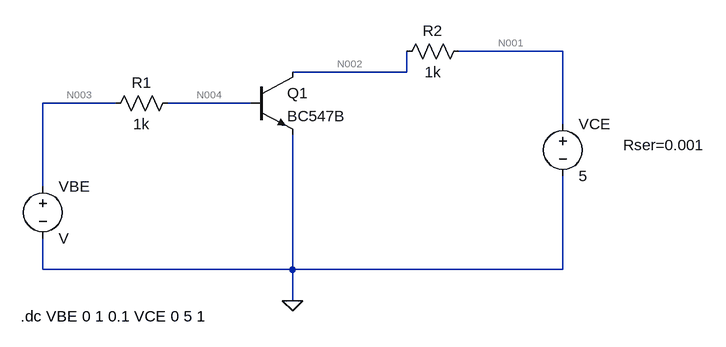
[diagram p0: schematic Draft1.asc]
Draft1.asc, the LTspice schematic file:
Version 4
SHEET 1 880 680
WIRE -160 -512 -320 -512
WIRE -400 -480 -400 -512
WIRE -400 -480 -576 -480
WIRE -848 -432 -960 -432
WIRE -640 -432 -768 -432
WIRE -160 -400 -160 -512
WIRE -960 -304 -960 -432
WIRE -960 -176 -960 -224
WIRE -576 -176 -576 -384
WIRE -576 -176 -960 -176
WIRE -160 -176 -160 -320
WIRE -160 -176 -576 -176
WIRE -576 -128 -576 -176
FLAG -576 -128 0
SYMBOL npn -640 -480 R0
SYMATTR InstName Q1
SYMATTR Value BC547B
SYMBOL voltage -960 -320 R0
SYMATTR InstName VBE
SYMBOL voltage -160 -416 R0
WINDOW 123 0 0 Left 0
WINDOW 39 93 48 Left 2
SYMATTR InstName VCE
SYMATTR Value 5
SYMATTR SpiceLine Rser=0.001
SYMBOL res -752 -448 R90
WINDOW 0 0 56 VBottom 2
WINDOW 3 32 56 VTop 2
SYMATTR InstName R1
SYMATTR Value 1k
SYMBOL res -304 -528 R90
WINDOW 0 0 56 VBottom 2
WINDOW 3 32 56 VTop 2
SYMATTR InstName R2
SYMATTR Value 1k
TEXT -994 -104 Left 2 !.dc VBE 0 1 0.1 VCE 0 5 1

The netlist it stands for:
* Draft1.asc
Q1 N002 N004 0 0 BC547B
VBE N003 0 V
VCE N001 0 5 Rser=0.001
R1 N004 N003 1k
R2 N001 N002 1k
.model NPN NPN
.model PNP PNP
.lib standard.bjt
.dc VBE 0 1 0.1 VCE 0 5 1
.backanno
.end

* Results of the author's LTspice run, read from the files saved beside the schematic
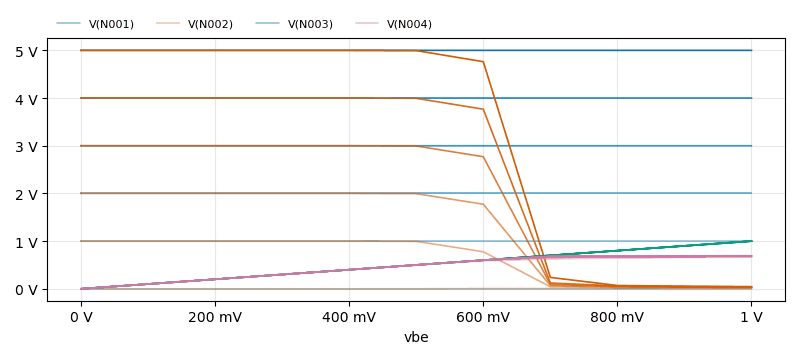
[diagram p1: DC transfer characteristic of Draft1.asc, plotted from the saved traces]
* DC transfer characteristic, 6 runs:
*   V(N001) [vce=0]: 0 V at vbe=0 V, 6.503 nV at vbe=1 V, min 0 V, max 6.503 nV
*   V(N001) [vce=1]: 1 V at vbe=0 V, 1 V at vbe=1 V, min 1 V, max 1 V
*   V(N001) [vce=2]: 2 V at vbe=0 V, 2 V at vbe=1 V, min 2 V, max 2 V
*   V(N001) [vce=3]: 3 V at vbe=0 V, 3 V at vbe=1 V, min 3 V, max 3 V
*   V(N001) [vce=4]: 4 V at vbe=0 V, 4 V at vbe=1 V, min 4 V, max 4 V
*   V(N001) [vce=5]: 5 V at vbe=0 V, 5 V at vbe=1 V, min 5 V, max 5 V
*   V(N002) [vce=0]: 0 V at vbe=0 V, 6.503 mV at vbe=1 V, min 0 V, max 6.503 mV
*   V(N002) [vce=1]: 1 V at vbe=0 V, 17.13 mV at vbe=1 V, min 17.13 mV, max 1 V
*   V(N002) [vce=2]: 2 V at vbe=0 V, 25.79 mV at vbe=1 V, min 25.79 mV, max 2 V
*   V(N002) [vce=3]: 3 V at vbe=0 V, 33.21 mV at vbe=1 V, min 33.21 mV, max 3 V
*   V(N002) [vce=4]: 4 V at vbe=0 V, 39.77 mV at vbe=1 V, min 39.77 mV, max 4 V
*   V(N002) [vce=5]: 5 V at vbe=0 V, 45.7 mV at vbe=1 V, min 45.7 mV, max 5 V
*   V(N003) [vce=0]: 0 V at vbe=0 V, 1 V at vbe=1 V, min 0 V, max 1 V
*   V(N003) [vce=1]: 0 V at vbe=0 V, 1 V at vbe=1 V, min 0 V, max 1 V
*   V(N003) [vce=2]: 0 V at vbe=0 V, 1 V at vbe=1 V, min 0 V, max 1 V
*   V(N003) [vce=3]: 0 V at vbe=0 V, 1 V at vbe=1 V, min 0 V, max 1 V
*   V(N003) [vce=4]: 0 V at vbe=0 V, 1 V at vbe=1 V, min 0 V, max 1 V
*   V(N003) [vce=5]: 0 V at vbe=0 V, 1 V at vbe=1 V, min 0 V, max 1 V
*   V(N004) [vce=0]: 0 V at vbe=0 V, 663.2 mV at vbe=1 V, min 0 V, max 663.2 mV
*   V(N004) [vce=1]: -353.5 pV at vbe=0 V, 671.7 mV at vbe=1 V, min -353.5 pV, max 671.7 mV
*   V(N004) [vce=2]: 646.5 pV at vbe=0 V, 678.7 mV at vbe=1 V, min 646.5 pV, max 678.7 mV
*   V(N004) [vce=3]: 1.646 nV at vbe=0 V, 684.4 mV at vbe=1 V, min 1.646 nV, max 684.4 mV
*   V(N004) [vce=4]: 2.646 nV at vbe=0 V, 689.3 mV at vbe=1 V, min 2.646 nV, max 689.3 mV
*   V(N004) [vce=5]: 3.646 nV at vbe=0 V, 693.7 mV at vbe=1 V, min 3.646 nV, max 693.7 mV